# EAGLE board bed_prod (EAGLE 9.5.0), part 1 of 3
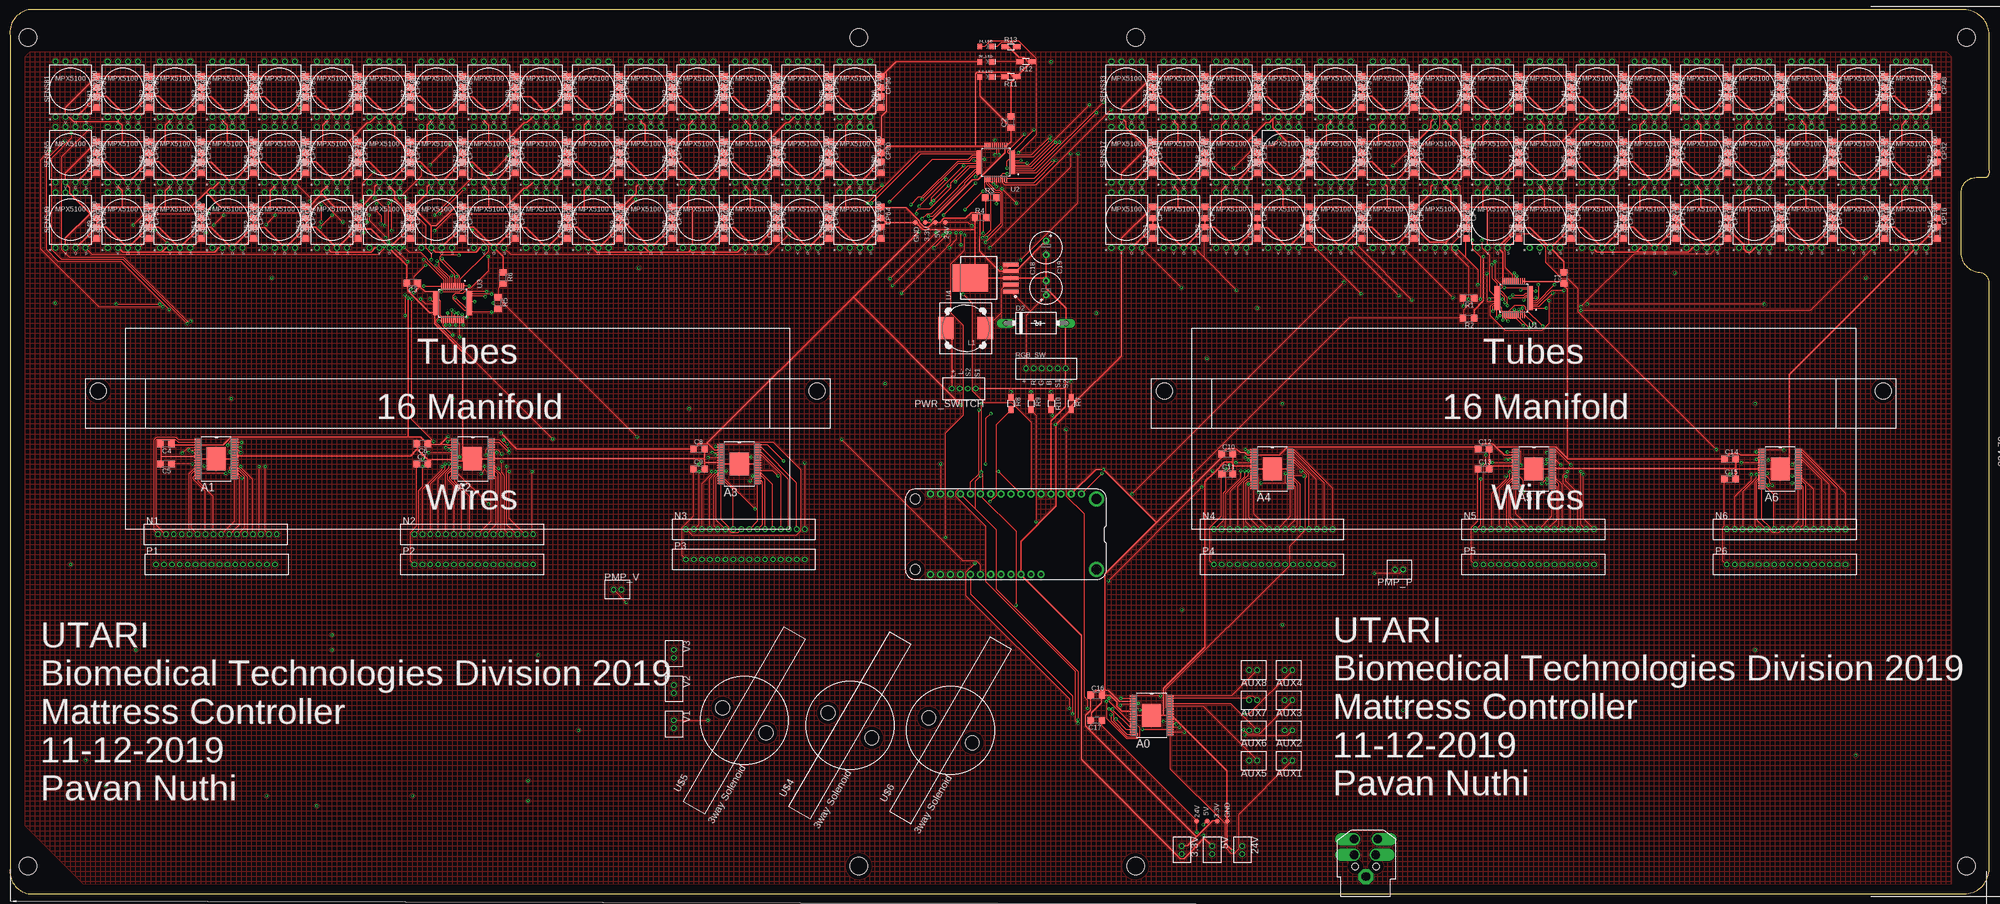
[diagram p2: board, top side]
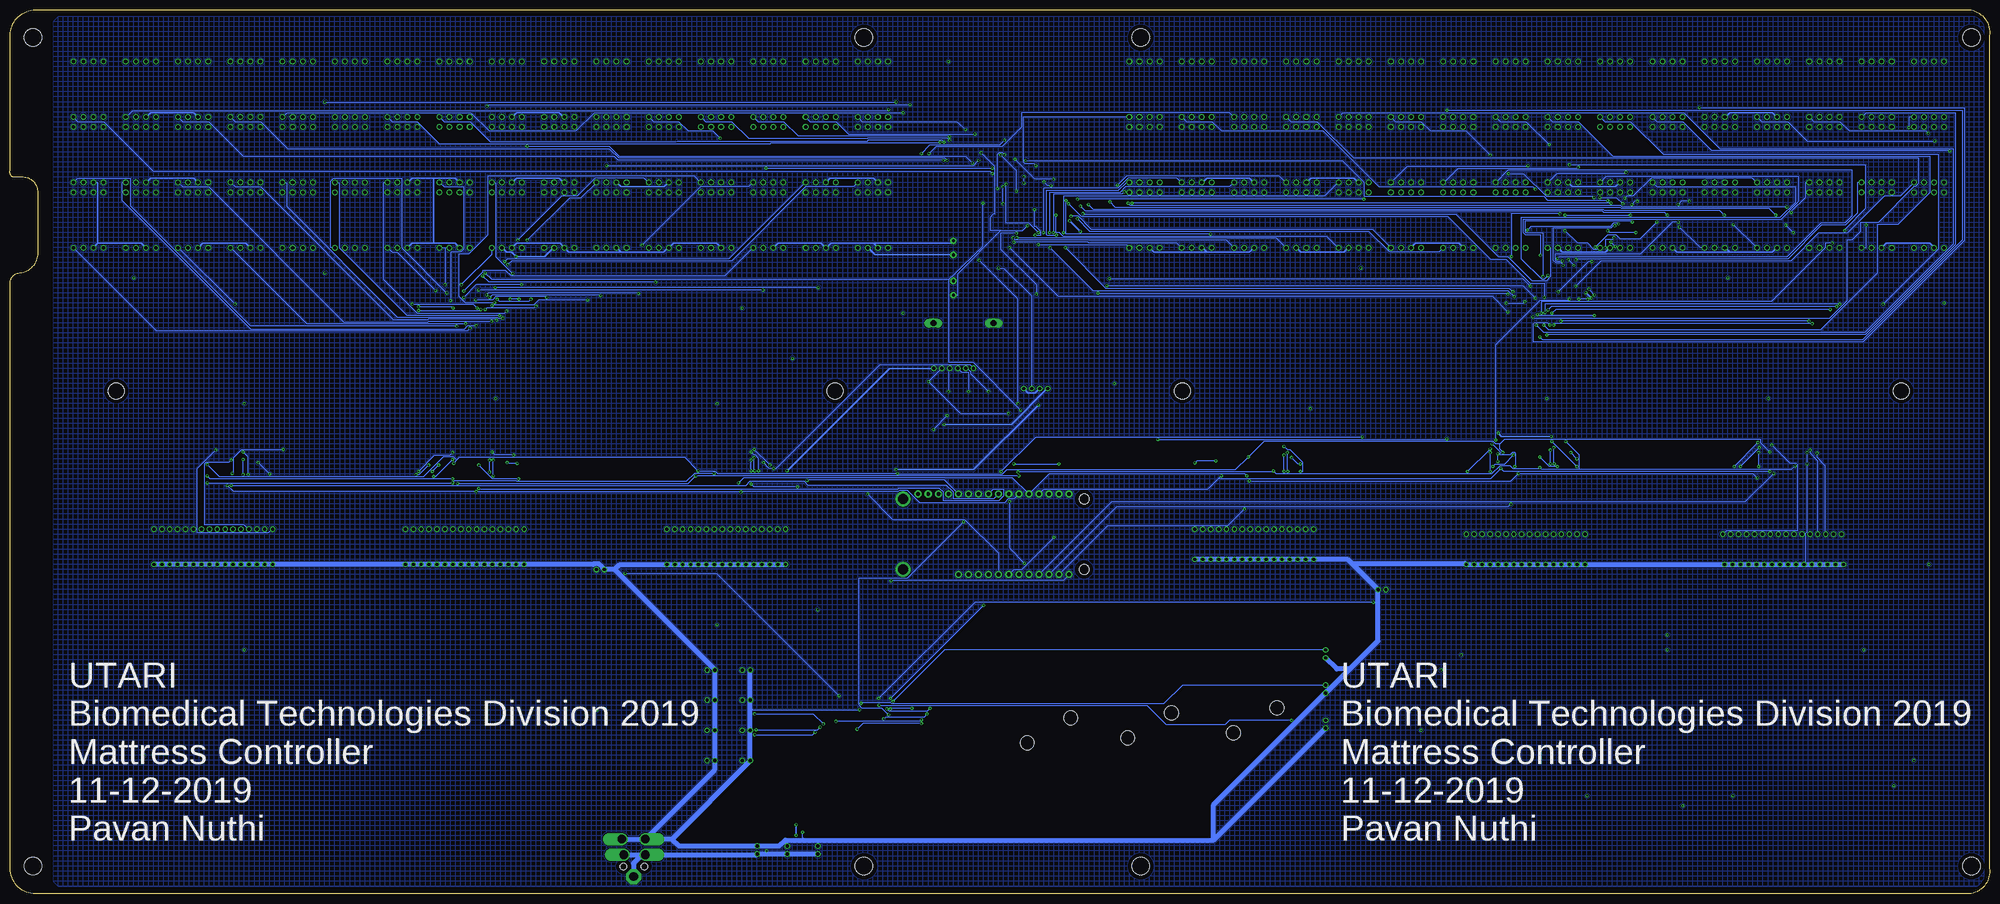
[diagram p3: board, bottom side, seen from below]

Size 499.97 x 223.3 mm. Coordinates in mm from the lower left corner, seen from the top.
Copper layers (1*16): Top 0.035mm / dielectric 1.5mm / Bottom 0.035mm
Design rules "default *": minimum track width 6mil, minimum drill 0.35mm, track to track 6mil, track to pad 6mil, pad to pad 6mil, via to via 6mil, smd to smd 6mil, copper to edge 40mil, drill to drill 6mil, minimum pad ring 10mil, minimum via ring 8mil, stop-mask expansion 4mil, vias tented up to drill 14mil, thermal gap 10mil
Net classes: 0 default: width 0.203 mm; 1 pwr: width 0.406 mm; 2 Vcc: width 1.27 mm

## Footprints (pad centres in the part's own frame; a part is rotated, then mirrored left to right if it is on the bottom)
LED-1206 = smd 1.2 x 1.4: A -1.5,0; C 1.5,0
2CONN_2MM = drill 0.85: P$1 0,0; P$2 2,0
SOIC65P1030X265-32N = smd 1.6 x 0.432: 1 -4.699,4.877; 2 -4.699,4.216; 3 -4.699,3.581; 4 -4.699,2.921; 5 -4.699,2.286; 6 -4.699,1.626; 7 -4.699,0.965; 8 -4.699,0.33; 9 -4.699,-0.33; 10 -4.699,-0.965; 11 -4.699,-1.626; 12 -4.699,-2.286; 13 -4.699,-2.921; 14 -4.699,-3.581; 15 -4.699,-4.216; 16 -4.699,-4.877; 17 4.699,-4.877; 18 4.699,-4.216; 19 4.699,-3.581; 20 4.699,-2.921; 21 4.699,-2.286; 22 4.699,-1.626; 23 4.699,-0.965; 24 4.699,-0.33; 25 4.699,0.33; 26 4.699,0.965; 27 4.699,1.626; 28 4.699,2.286; 29 4.699,2.921; 30 4.699,3.581; 31 4.699,4.216; 32 4.699,4.877 | smd 4.801 x 5.893: 33 0,0
C1206 = smd 1.6 x 1.8: 1 -1.4,0; 2 1.4,0
E3,5-8 = drill 0.813 pad 1.6: + -1.778,0 | drill 0.813 pad 1.6 octagon: - 1.778,0
DO201T15 = drill 1.499 long: A 7.62,0; C -7.62,0
KYCON-KPXJ-4S = drill 2.2 pad 3.81 octagon: GND 0,-8 | drill 2.2 pad 2.54 offset: GND_ -3,-2.5; GND__ 2.5,-2.5; V+ 3,1.5; V++ -3,1.5 | hole 1.7: 2.54,-5.461; -2.667,-5.461
DR127 = smd 3.85 x 5.5: 1 -4.975,0; 2 4.975,0
FEATHERWING_DIM = drill 1 pad 1.778: 1 6.35,1.27; 2 8.89,1.27; 3 11.43,1.27; 4 13.97,1.27; 5 16.51,1.27; 6 19.05,1.27; 7 21.59,1.27; 8 24.13,1.27; 9 26.67,1.27; 10 29.21,1.27; 11 31.75,1.27; 12 34.29,1.27; 13 36.83,1.27; 14 39.37,1.27; 15 41.91,1.27; 16 44.45,1.27; 17 44.45,21.59; 18 41.91,21.59; 19 39.37,21.59; 20 36.83,21.59; 21 34.29,21.59; 22 31.75,21.59; 23 29.21,21.59; 24 26.67,21.59; 25 24.13,21.59; 26 21.59,21.59; 27 19.05,21.59; 28 16.51,21.59 | drill 2.5 pad 3.81: P$1 2.54,20.32; P$2 2.54,2.54 | hole 2.54: 48.26,20.32; 48.26,2.54
16CONN_2MM = drill 0.85: P1 -2.54,15.24; P2 -2.54,13.24; P3 -2.54,11.24; P4 -2.54,9.24; P5 -2.54,7.24; P6 -2.54,5.24; P7 -2.54,3.24; P8 -2.54,1.24; P9 -2.54,-0.76; P10 -2.54,-2.76; P11 -2.54,-4.76; P12 -2.54,-6.76; P13 -2.54,-8.76; P14 -2.54,-10.76; P15 -2.54,-12.76; P16 -2.54,-14.76
4CONN_2MM = drill 0.85: P$1 0,0; P$2 2,0; P$3 4,0; P$4 6,0
R1206 = smd 1.6 x 1.803: 1 -1.422,0; 2 1.422,0
R1206W = smd 1.8 x 1.2: 1 -1.499,0; 2 1.499,0
6CONN_2MM = drill 0.85: P$1 0,0; P$2 2,0; P$3 4,0; P$4 6,0; P$5 8,0; P$6 10,0
98ASB17759C = drill 0.9: 1 0,0; 2 2.54,0; 3 5.08,0; 4 7.62,0; 5 7.62,14; 6 5.08,14; 7 2.54,14; 8 0,14
PAD.03X.05 = smd 1.27 x 1.27: P$1 0,0
QFP50P900X900X160-49N = smd 1.49 x 0.28: 1 -4.17,2.75; 2 -4.17,2.25; 3 -4.17,1.75; 4 -4.17,1.25; 5 -4.17,0.75; 6 -4.17,0.25; 7 -4.17,-0.25; 8 -4.17,-0.75; 9 -4.17,-1.25; 10 -4.17,-1.75; 11 -4.17,-2.25; 12 -4.17,-2.75; 25 4.17,-2.75; 26 4.17,-2.25; 27 4.17,-1.75; 28 4.17,-1.25; 29 4.17,-0.75; 30 4.17,-0.25; 31 4.17,0.25; 32 4.17,0.75; 33 4.17,1.25; 34 4.17,1.75; 35 4.17,2.25; 36 4.17,2.75 | smd 0.28 x 1.49: 13 -2.75,-4.17; 14 -2.25,-4.17; 15 -1.75,-4.17; 16 -1.25,-4.17; 17 -0.75,-4.17; 18 -0.25,-4.17; 19 0.25,-4.17; 20 0.75,-4.17; 21 1.25,-4.17; 22 1.75,-4.17; 23 2.25,-4.17; 24 2.75,-4.17; 37 2.75,4.17; 38 2.25,4.17; 39 1.75,4.17; 40 1.25,4.17; 41 0.75,4.17; 42 0.25,4.17; 43 -0.25,4.17; 44 -0.75,4.17; 45 -1.25,4.17; 46 -1.75,4.17; 47 -2.25,4.17; 48 -2.75,4.17
DPAK6P170_1524X459L254X81N = smd 1 x 4: 1 -3.4,-6.33; 2 -1.7,-6.33; 3 0,-6.33; 4 1.7,-6.33; 5 3.4,-6.33 | smd 7 x 9: 6 0,3.91
MANIFOLD16 = hole 4.089: 3.175,3.175; 184.785,3.175
PTS-25349-C = hole 4.5: 0,0; 209.3,0; 209.3,209.8; 0,209.8; 209.3,279.7; 0,279.7; 209.3,489.5; 0,489.5
EVO-3-24 = hole 3.556: 0,6.35; 0,-6.35

## Placement (x,y rotation side)
3.3_LED  yellow  [LED-1206]  246.45,206.39 0 top
3.3V  2CONN_2MM  [2CONN_2MM]  295.98,12.08 270 top
5V  2CONN_2MM  [2CONN_2MM]  303.6,12.08 270 top
5V_LED  RED  [LED-1206]  246.45,210.2 0 top
24_LED  GREEN  [LED-1206]  246.45,214.01 0 top
24V  2CONN_2MM  [2CONN_2MM]  311.22,12.08 270 top
A0  MC33996EKR2  [SOIC65P1030X265-32N]  288.36,45.1 0 top
A1  MC33996EKR2  [SOIC65P1030X265-32N]  52.14,109.87 0 top
A2  MC33996EKR2  [SOIC65P1030X265-32N]  116.91,109.87 0 top
A3  MC33996EKR2  [SOIC65P1030X265-32N]  184.22,108.6 0 top
A4  MC33996EKR2  [SOIC65P1030X265-32N]  318.84,107.33 0 top
A5  MC33996EKR2  [SOIC65P1030X265-32N]  384.88,107.33 0 top
A6  MC33996EKR2  [SOIC65P1030X265-32N]  447.11,107.33 0 top
AUX1  2CONN_2MM  [2CONN_2MM]  323.92,33.67 180 top
AUX2  2CONN_2MM  [2CONN_2MM]  323.92,41.29 180 top
AUX3  2CONN_2MM  [2CONN_2MM]  323.92,48.91 180 top
AUX4  2CONN_2MM  [2CONN_2MM]  323.92,56.53 180 top
AUX5  2CONN_2MM  [2CONN_2MM]  315.03,33.67 180 top
AUX6  2CONN_2MM  [2CONN_2MM]  315.03,41.29 180 top
AUX7  2CONN_2MM  [2CONN_2MM]  315.03,48.91 180 top
AUX8  2CONN_2MM  [2CONN_2MM]  315.03,56.53 180 top
C1  0.1uF  [C1206]  392.5,155.59 90 top
C2  0.1uF  [C1206]  252.8,194.96 90 top
C3  0.1uF  [C1206]  101.67,154.32 180 top
C4  0.1uF  [C1206]  39.44,113.68 180 top
C5  0.1uF  [C1206]  39.44,108.6 180 top
C6  0.1uF  [C1206]  104.21,113.68 180 top
C7  0.1uF  [C1206]  104.21,108.6 0 top
C8  0.1uF  [C1206]  174.06,112.41 0 top
C9  0.1uF  [C1206]  174.06,107.33 0 top
C10  0.1uF  [C1206]  307.41,111.14 0 top
C11  0.1uF  [C1206]  307.41,106.06 0 top
C12  0.1uF  [C1206]  372.18,112.41 0 top
C13  0.1uF  [C1206]  372.18,107.33 0 top
C14  0.1uF  [C1206]  434.41,109.87 0 top
C15  0.1uF  [C1206]  434.41,104.79 0 top
C16  0.1uF  [C1206]  274.39,50.18 0 top
C17  0.1uF  [C1206]  274.39,43.83 180 top
C18  100uF,50V  [E3,5-8]  261.69,153.05 90 top
C19  330uF,10V  [E3,5-8]  261.69,163.21 270 top
CP1  1uF  [C1206]  288.61,172.1 270 top
CP2  1uF  [C1206]  301.82,172.1 270 top
CP3  1uF  [C1206]  315.03,172.1 270 top
CP4  1uF  [C1206]  328.23,172.1 270 top
CP5  1uF  [C1206]  341.44,172.1 270 top
CP6  [C1206]  354.65,172.1 270 top
CP7  [C1206]  367.86,172.1 270 top
CP8  1uF  [C1206]  381.07,172.1 270 top
CP9  1uF  [C1206]  394.27,172.1 270 top
CP10  1uF  [C1206]  407.48,172.1 270 top
CP11  1uF  [C1206]  420.69,172.1 270 top
CP12  1uF  [C1206]  433.9,172.1 270 top
CP13  1uF  [C1206]  447.11,172.1 270 top
CP14  [C1206]  460.31,172.1 270 top
CP15  [C1206]  473.52,172.1 270 top
CP16  [C1206]  486.73,172.1 270 top
CP17  1uF  [C1206]  288.61,188.61 270 top
CP18  [C1206]  301.82,188.61 270 top
CP19  [C1206]  315.03,188.61 270 top
CP20  [C1206]  328.23,188.61 270 top
CP21  [C1206]  341.44,188.61 270 top
CP22  [C1206]  354.65,188.61 270 top
CP23  [C1206]  367.86,188.61 270 top
CP24  [C1206]  381.07,188.61 270 top
CP25  [C1206]  394.27,188.61 270 top
CP26  [C1206]  407.48,188.61 270 top
CP27  [C1206]  420.69,188.61 270 top
CP28  [C1206]  433.9,188.61 270 top
CP29  [C1206]  447.11,188.61 270 top
CP30  [C1206]  460.31,188.61 270 top
CP31  [C1206]  473.52,188.61 270 top
CP32  [C1206]  486.73,188.61 270 top
CP33  [C1206]  288.61,205.12 270 top
CP34  [C1206]  301.82,205.12 270 top
CP35  [C1206]  315.03,205.12 270 top
CP36  [C1206]  328.23,205.12 270 top
CP37  [C1206]  341.44,205.12 270 top
CP38  [C1206]  354.65,205.12 270 top
CP39  [C1206]  367.86,205.12 270 top
CP40  [C1206]  381.07,205.12 270 top
CP41  [C1206]  394.27,205.12 270 top
CP42  [C1206]  407.48,205.12 270 top
CP43  [C1206]  420.69,205.12 270 top
CP44  [C1206]  433.9,205.12 270 top
CP45  [C1206]  447.11,205.12 270 top
CP46  [C1206]  460.31,205.12 270 top
CP47  [C1206]  473.52,205.12 270 top
CP48  [C1206]  486.73,205.12 270 top
CP49  [C1206]  21.91,172.1 270 top
CP50  [C1206]  35.12,172.1 270 top
CP51  [C1206]  48.33,172.1 270 top
CP52  [C1206]  61.53,172.1 270 top
CP53  [C1206]  74.74,172.1 270 top
CP54  [C1206]  87.95,172.1 270 top
CP55  [C1206]  101.16,172.1 270 top
CP56  [C1206]  114.37,172.1 270 top
CP57  [C1206]  127.57,172.1 270 top
CP58  [C1206]  140.78,172.1 270 top
CP59  [C1206]  153.99,172.1 270 top
CP60  [C1206]  167.2,172.1 270 top
CP61  [C1206]  180.41,172.1 270 top
CP62  [C1206]  193.61,172.1 270 top
CP63  [C1206]  206.82,172.1 270 top
CP64  [C1206]  220.03,172.1 270 top
CP65  [C1206]  21.91,188.61 270 top
CP66  [C1206]  35.12,188.61 270 top
CP67  [C1206]  48.33,188.61 270 top
CP68  [C1206]  61.53,188.61 270 top
CP69  [C1206]  74.74,188.61 270 top
CP70  [C1206]  87.95,188.61 270 top
CP71  [C1206]  101.16,188.61 270 top
CP72  [C1206]  114.37,188.61 270 top
CP73  [C1206]  127.57,188.61 270 top
CP74  [C1206]  140.78,188.61 270 top
CP75  [C1206]  153.99,188.61 270 top
CP76  [C1206]  167.2,188.61 270 top
CP77  [C1206]  180.41,188.61 270 top
CP78  [C1206]  193.61,188.61 270 top
CP79  [C1206]  206.82,188.61 270 top
CP80  [C1206]  220.03,188.61 270 top
CP81  [C1206]  21.91,205.12 270 top
CP82  [C1206]  35.12,205.12 270 top
CP83  [C1206]  48.33,205.12 270 top
CP84  [C1206]  61.53,205.12 270 top
CP85  [C1206]  74.74,205.12 270 top
CP86  [C1206]  87.95,205.12 270 top
CP87  [C1206]  101.16,205.12 270 top
CP88  [C1206]  114.37,205.12 270 top
CP89  [C1206]  127.57,205.12 270 top
CP90  [C1206]  140.78,205.12 270 top
CP91  [C1206]  153.99,205.12 270 top
CP92  [C1206]  167.2,205.12 270 top
CP93  [C1206]  180.41,205.12 270 top
CP94  [C1206]  193.61,205.12 270 top
CP95  [C1206]  206.82,205.12 270 top
CP96  [C1206]  220.03,205.12 270 top
CS1  [C1206]  288.61,167.02 90 top
CS2  [C1206]  301.82,167.02 90 top
CS3  [C1206]  315.03,167.02 90 top
CS4  [C1206]  328.23,167.02 90 top
CS5  [C1206]  341.44,167.02 90 top
CS6  [C1206]  354.65,167.02 90 top
CS7  [C1206]  367.86,167.02 90 top
CS8  470pF  [C1206]  381.07,167.02 90 top
CS9  [C1206]  394.27,167.02 90 top
CS10  [C1206]  407.48,167.02 90 top
CS11  [C1206]  420.69,167.02 90 top
CS12  [C1206]  433.9,167.02 90 top
CS13  [C1206]  447.11,167.02 90 top
CS14  [C1206]  460.31,167.02 90 top
CS15  [C1206]  473.52,167.02 90 top
CS16  [C1206]  486.73,167.02 90 top
CS17  [C1206]  288.61,183.53 90 top
CS18  [C1206]  301.82,183.53 90 top
CS19  [C1206]  315.03,183.53 90 top
CS20  [C1206]  328.23,183.53 90 top
CS21  [C1206]  341.44,183.53 90 top
CS22  [C1206]  354.65,183.53 90 top
CS23  [C1206]  367.86,183.53 90 top
CS24  [C1206]  381.07,183.53 90 top
CS25  [C1206]  394.27,183.53 90 top
CS26  [C1206]  407.48,183.53 90 top
CS27  [C1206]  420.69,183.53 90 top
CS28  [C1206]  433.9,183.53 90 top
CS29  [C1206]  447.11,183.53 90 top
CS30  [C1206]  460.31,183.53 90 top
CS31  [C1206]  473.52,183.53 90 top
CS32  [C1206]  486.73,183.53 90 top
CS33  [C1206]  288.61,200.04 90 top
CS34  [C1206]  301.82,200.04 90 top
CS35  [C1206]  315.03,200.04 90 top
CS36  [C1206]  328.23,200.04 90 top
CS37  [C1206]  341.44,200.04 90 top
CS38  [C1206]  354.65,200.04 90 top
CS39  [C1206]  367.86,200.04 90 top
CS40  [C1206]  381.07,200.04 90 top
CS41  [C1206]  394.27,200.04 90 top
CS42  [C1206]  407.48,200.04 90 top
CS43  [C1206]  420.69,200.04 90 top
CS44  [C1206]  433.9,200.04 90 top
CS45  [C1206]  447.11,200.04 90 top
CS46  [C1206]  460.31,200.04 90 top
CS47  [C1206]  473.52,200.04 90 top
CS48  [C1206]  486.73,200.04 90 top
CS49  [C1206]  21.91,167.02 90 top
CS50  [C1206]  35.12,167.02 90 top
CS51  [C1206]  48.33,167.02 90 top
CS52  [C1206]  61.53,167.02 90 top
CS53  [C1206]  74.74,167.02 90 top
CS54  [C1206]  87.95,167.02 90 top
CS55  [C1206]  101.16,167.02 90 top
CS56  [C1206]  114.37,167.02 90 top
CS57  [C1206]  127.57,167.02 90 top
CS58  [C1206]  140.78,167.02 90 top
CS59  [C1206]  153.99,167.02 90 top
CS60  [C1206]  167.2,167.02 90 top
CS61  [C1206]  180.41,167.02 90 top
CS62  [C1206]  193.61,167.02 90 top
CS63  [C1206]  206.82,167.02 90 top
CS64  [C1206]  220.03,167.02 90 top
CS65  [C1206]  21.91,183.53 90 top
CS66  [C1206]  35.12,183.53 90 top
CS67  [C1206]  48.33,183.53 90 top
CS68  [C1206]  61.53,183.53 90 top
CS69  [C1206]  74.74,183.53 90 top
CS70  [C1206]  87.95,183.53 90 top
CS71  [C1206]  101.16,183.53 90 top
CS72  [C1206]  114.37,183.53 90 top
CS73  [C1206]  127.57,183.53 90 top
CS74  [C1206]  140.78,183.53 90 top
CS75  [C1206]  153.99,183.53 90 top
CS76  [C1206]  167.2,183.53 90 top
CS77  [C1206]  180.41,183.53 90 top
CS78  [C1206]  193.61,183.53 90 top
CS79  [C1206]  206.82,183.53 90 top
CS80  [C1206]  220.03,183.53 90 top
CS81  [C1206]  21.91,200.04 90 top
CS82  [C1206]  35.12,200.04 90 top
CS83  [C1206]  48.33,200.04 90 top
CS84  [C1206]  61.53,200.04 90 top
CS85  [C1206]  74.74,200.04 90 top
CS86  [C1206]  87.95,200.04 90 top
CS87  [C1206]  101.16,200.04 90 top
CS88  [C1206]  114.37,200.04 90 top
CS89  [C1206]  127.57,200.04 90 top
CS90  [C1206]  140.78,200.04 90 top
CS91  [C1206]  153.99,200.04 90 top
CS92  [C1206]  167.2,200.04 90 top
CS93  [C1206]  180.41,200.04 90 top
CS94  [C1206]  193.61,200.04 90 top
CS95  [C1206]  206.82,200.04 90 top
CS96  [C1206]  220.03,200.04 90 top
D2  1N5822  [DO201T15]  259.15,144.16 0 top
FRAME1  FRAME-LEDGER  [CREATIVE_COMMONS]  4.89,87.77 90 bottom
FRAME2  FRAME-LEDGER  [CREATIVE_COMMONS]  498.16,116.22 270 bottom
J1  KPJX-4S-S  [KYCON-KPXJ-4S]  342.46,12.33 0 top
L1  330uH  [DR127]  241.37,142.89 180 top
MS1  FEATHERWING_NODIM  [FEATHERWING_DIM]  276.93,102.25 180 top
N1  16CONN_2MM  [16CONN_2MM]  52.14,88.28 270 top
N2  16CONN_2MM  [16CONN_2MM]  116.91,88.28 270 top
N3  16CONN_2MM  [16CONN_2MM]  185.49,89.55 270 top
N4  16CONN_2MM  [16CONN_2MM]  318.84,89.55 270 top
N5  16CONN_2MM  [16CONN_2MM]  384.88,89.55 270 top
N6  16CONN_2MM  [16CONN_2MM]  448.38,89.55 270 top
P1  16CONN_2MM  [16CONN_2MM]  52.14,85.74 90 top
P2  16CONN_2MM  [16CONN_2MM]  116.91,80.66 270 top
P3  16CONN_2MM  [16CONN_2MM]  185.49,81.93 270 top
P4  16CONN_2MM  [16CONN_2MM]  318.84,80.66 270 top
P5  16CONN_2MM  [16CONN_2MM]  384.88,80.66 270 top
P6  16CONN_2MM  [16CONN_2MM]  448.38,80.66 270 top
PMP_P  2CONN_2MM  [2CONN_2MM]  351.86,81.93 180 top
PMP_V  2CONN_2MM  [2CONN_2MM]  152.47,76.85 0 top
PWR_SWITCH  4CONN_2MM  [4CONN_2MM]  243.91,127.65 180 top
R1  1k  [R1206]  368.37,150.51 180 top
R2  2k  [R1206]  368.37,145.43 180 top
R3  1k  [R1206]  247.72,175.91 0 top
R4  2k  [R1206]  245.18,170.83 0 top
R5  1k  [R1206]  123.26,149.24 270 top
R6  2k  [R1206]  124.53,155.59 270 top
R7  5k  [R1206W]  268.04,123.84 270 top
R8  5K  [R1206W]  252.8,123.84 270 top
R9  5k  [R1206W]  257.88,123.84 270 top
R10  5k  [R1206W]  262.96,123.84 270 top
R11  5k  [R1206W]  252.8,206.39 180 top
R12  5k  [R1206W]  256.61,210.2 180 top
R13  10k  [R1206W]  252.8,214.01 0 top
RGB_SW  6CONN_2MM  [6CONN_2MM]  256.61,132.73 0 top
SENS1  MPX5100  [98ASB17759C]  278.2,163.21 0 top
SENS2  MPX5100  [98ASB17759C]  291.4,163.21 0 top
SENS3  MPX5100  [98ASB17759C]  304.61,163.21 0 top
SENS4  MPX5100  [98ASB17759C]  317.82,163.21 0 top
SENS5  MPX5100  [98ASB17759C]  331.03,163.21 0 top
SENS6  MPX5100  [98ASB17759C]  344.24,163.21 0 top
SENS7  MPX5100  [98ASB17759C]  357.44,163.21 0 top
SENS8  MPX5100  [98ASB17759C]  370.65,163.21 0 top
SENS9  MPX5100  [98ASB17759C]  383.86,163.21 0 top
SENS10  MPX5100  [98ASB17759C]  397.07,163.21 0 top
SENS11  MPX5100  [98ASB17759C]  410.28,163.21 0 top
SENS12  MPX5100  [98ASB17759C]  423.48,163.21 0 top
SENS13  MPX5100  [98ASB17759C]  436.69,163.21 0 top
SENS14  MPX5100  [98ASB17759C]  449.9,163.21 0 top
SENS15  MPX5100  [98ASB17759C]  463.11,163.21 0 top
SENS16  MPX5100  [98ASB17759C]  476.32,163.21 0 top
SENS17  MPX5100  [98ASB17759C]  278.2,179.72 0 top
SENS18  MPX5100  [98ASB17759C]  291.4,179.72 0 top
SENS19  MPX5100  [98ASB17759C]  304.61,179.72 0 top
SENS20  MPX5100  [98ASB17759C]  317.82,179.72 0 top
SENS21  MPX5100  [98ASB17759C]  331.03,179.72 0 top
SENS22  MPX5100  [98ASB17759C]  344.24,179.72 0 top
SENS23  MPX5100  [98ASB17759C]  357.44,179.72 0 top
SENS24  MPX5100  [98ASB17759C]  370.65,179.72 0 top
SENS25  MPX5100  [98ASB17759C]  383.86,179.72 0 top
SENS26  MPX5100  [98ASB17759C]  397.07,179.72 0 top
SENS27  MPX5100  [98ASB17759C]  410.28,179.72 0 top
SENS28  MPX5100  [98ASB17759C]  423.48,179.72 0 top
SENS29  MPX5100  [98ASB17759C]  436.69,179.72 0 top
SENS30  MPX5100  [98ASB17759C]  449.9,179.72 0 top
SENS31  MPX5100  [98ASB17759C]  463.11,179.72 0 top
SENS32  MPX5100  [98ASB17759C]  476.32,179.72 0 top
SENS33  MPX5100  [98ASB17759C]  278.2,196.23 0 top
SENS34  MPX5100  [98ASB17759C]  291.4,196.23 0 top
SENS35  MPX5100  [98ASB17759C]  304.61,196.23 0 top
SENS36  MPX5100  [98ASB17759C]  317.82,196.23 0 top
SENS37  MPX5100  [98ASB17759C]  331.03,196.23 0 top
SENS38  MPX5100  [98ASB17759C]  344.24,196.23 0 top
SENS39  MPX5100  [98ASB17759C]  357.44,196.23 0 top
SENS40  MPX5100  [98ASB17759C]  370.65,196.23 0 top
SENS41  MPX5100  [98ASB17759C]  383.86,196.23 0 top
SENS42  MPX5100  [98ASB17759C]  397.07,196.23 0 top
SENS43  MPX5100  [98ASB17759C]  410.28,196.23 0 top
SENS44  MPX5100  [98ASB17759C]  423.48,196.23 0 top
SENS45  MPX5100  [98ASB17759C]  436.69,196.23 0 top
SENS46  MPX5100  [98ASB17759C]  449.9,196.23 0 top
SENS47  MPX5100  [98ASB17759C]  463.11,196.23 0 top
SENS48  MPX5100  [98ASB17759C]  476.32,196.23 0 top
SENS49  MPX5100  [98ASB17759C]  11.5,163.21 0 top
SENS50  MPX5100  [98ASB17759C]  24.7,163.21 0 top
SENS51  MPX5100  [98ASB17759C]  37.91,163.21 0 top
SENS52  MPX5100  [98ASB17759C]  51.12,163.21 0 top
SENS53  MPX5100  [98ASB17759C]  64.33,163.21 0 top
SENS54  MPX5100  [98ASB17759C]  77.54,163.21 0 top
SENS55  MPX5100  [98ASB17759C]  90.74,163.21 0 top
SENS56  MPX5100  [98ASB17759C]  103.95,163.21 0 top
SENS57  MPX5100  [98ASB17759C]  117.16,163.21 0 top
SENS58  MPX5100  [98ASB17759C]  130.37,163.21 0 top
SENS59  MPX5100  [98ASB17759C]  143.58,163.21 0 top
SENS60  MPX5100  [98ASB17759C]  156.78,163.21 0 top
SENS61  MPX5100  [98ASB17759C]  169.99,163.21 0 top
SENS62  MPX5100  [98ASB17759C]  183.2,163.21 0 top
SENS63  MPX5100  [98ASB17759C]  196.41,163.21 0 top
SENS64  MPX5100  [98ASB17759C]  209.62,163.21 0 top
SENS65  MPX5100  [98ASB17759C]  11.5,179.72 0 top
SENS66  MPX5100  [98ASB17759C]  24.7,179.72 0 top
SENS67  MPX5100  [98ASB17759C]  37.91,179.72 0 top
SENS68  MPX5100  [98ASB17759C]  51.12,179.72 0 top
SENS69  MPX5100  [98ASB17759C]  64.33,179.72 0 top
SENS70  MPX5100  [98ASB17759C]  77.54,179.72 0 top
SENS71  MPX5100  [98ASB17759C]  90.74,179.72 0 top
SENS72  MPX5100  [98ASB17759C]  103.95,179.72 0 top
SENS73  MPX5100  [98ASB17759C]  117.16,179.72 0 top
SENS74  MPX5100  [98ASB17759C]  130.37,179.72 0 top
SENS75  MPX5100  [98ASB17759C]  143.58,179.72 0 top
SENS76  MPX5100  [98ASB17759C]  156.78,179.72 0 top
SENS77  MPX5100  [98ASB17759C]  169.99,179.72 0 top
SENS78  MPX5100  [98ASB17759C]  183.2,179.72 0 top
SENS79  MPX5100  [98ASB17759C]  196.41,179.72 0 top
SENS80  MPX5100  [98ASB17759C]  209.62,179.72 0 top
SENS81  MPX5100  [98ASB17759C]  11.5,196.23 0 top
SENS82  MPX5100  [98ASB17759C]  24.7,196.23 0 top
SENS83  MPX5100  [98ASB17759C]  37.91,196.23 0 top
SENS84  MPX5100  [98ASB17759C]  51.12,196.23 0 top
SENS85  MPX5100  [98ASB17759C]  64.33,196.23 0 top
SENS86  MPX5100  [98ASB17759C]  77.54,196.23 0 top
SENS87  MPX5100  [98ASB17759C]  90.74,196.23 0 top
SENS88  MPX5100  [98ASB17759C]  103.95,196.23 0 top
SENS89  MPX5100  [98ASB17759C]  117.16,196.23 0 top
SENS90  MPX5100  [98ASB17759C]  130.37,196.23 0 top
SENS91  MPX5100  [98ASB17759C]  143.58,196.23 0 top
SENS92  MPX5100  [98ASB17759C]  156.78,196.23 0 top
SENS93  MPX5100  [98ASB17759C]  169.99,196.23 0 top
SENS94  MPX5100  [98ASB17759C]  183.2,196.23 0 top
SENS95  MPX5100  [98ASB17759C]  196.41,196.23 0 top
SENS96  MPX5100  [98ASB17759C]  209.62,196.23 0 top
TP1  TEST-POINT3X5  [PAD.03X.05]  299.79,18.43 90 top
TP2  TEST-POINT3X5  [PAD.03X.05]  302.33,18.43 90 top
TP3  TEST-POINT3X5  [PAD.03X.05]  304.87,18.43 90 top
TP4  TEST-POINT3X5  [PAD.03X.05]  307.41,18.43 90 top
TP5  TEST-POINT3X5  [PAD.03X.05]  236.29,169.56 270 top
TP6  TEST-POINT3X5  [PAD.03X.05]  233.75,169.56 270 top
TP7  TEST-POINT3X5  [PAD.03X.05]  231.21,169.56 270 top
TP8  TEST-POINT3X5  [PAD.03X.05]  228.67,169.56 270 top
U1  ADG731  [QFP50P900X900X160-49N]  379.8,150.51 180 top
U2  ADG731  [QFP50P900X900X160-49N]  248.99,184.8 180 top
U3  ADG731  [QFP50P900X900X160-49N]  111.83,149.24 270 top
U4  LM2576-5.0WU  [DPAK6P170_1524X459L254X81N]  246.45,155.59 90 top
U$1  [MANIFOLD16]  207.08,130.19 180 top
U$2  [PTS-25349-C]  494.1,7 90 top
U$3  [MANIFOLD16]  476.32,130.19 180 top
U$4  [EVO-3-24]  212.16,42.56 60 top
U$5  [EVO-3-24]  185.49,43.83 60 top
U$6  [EVO-3-24]  237.56,41.29 60 top
V1  2CONN_2MM  [2CONN_2MM]  167.71,43.83 270 top
V2  2CONN_2MM  [2CONN_2MM]  167.71,52.72 270 top
V3  2CONN_2MM  [2CONN_2MM]  167.71,61.61 270 top

## Tracks (layer width: path | path; a pad name or v marks a point on that pad's centre or on a via)
A0  (via drill 0.35)
  Top 0.203: R1.1 369.64,150.51 369.64,150.03 367.1,147.49 367.1,145.43 R2.2 338.2,145.43 298.67,105.9 v298.67,104.47
  Bottom 0.203: MS1.5 264.07,104.63 298.52,104.63 v298.67,104.47
A1  (via drill 0.35)
  Top 0.203: 246.45,170.83 246.45,175.91 R3.1 | MS1.6 257.88,119.24 252.95,124.16 245.97,124.16 242.95,127.17 242.95,149.24 v240.73,151.46 | v245.81,166.86 245.81,170.2 246.45,170.83 | 246.45,170.83 R4.2
  Bottom 0.203: v240.73,151.46 240.73,153.84 249.78,162.89 249.78,166.86 v245.81,166.86
A2  (via drill 0.35)
  Top 0.203: R6.2 123.26,152.89 R5.1 123.26,150.51 v158.34,115.43 | MS1.7 v249.62,106.7
  Bottom 0.203: v158.34,115.43 240.89,115.43 v249.62,106.7
AUX1
  Top 0.203: AUX1.P$1 310.26,20.02 310.26,11.29 309.15,10.18 308.52,10.18 306.93,11.76 306.93,17.64 293.12,31.45 293.12,40.18 A0.17
AUX2  (via drill 0.35)
  Top 0.203: v296.61,40.81 293.12,40.81 A0.18 | v311.85,40.18 312.17,40.18 312.49,39.86 322.49,39.86 AUX2.P$1
  Bottom 0.203: v296.61,40.81 297.25,40.18 v311.85,40.18
AUX3  (via drill 0.35)
  Top 0.203: v295.34,42.08 293.12,42.08 A0.20 | v311.53,41.45 312.64,40.34 315.5,40.34 323.92,48.75 AUX3.P$1
  Bottom 0.203: v295.34,42.08 295.98,41.45 v311.53,41.45
AUX4  (via drill 0.35)
  Top 0.203: v294.55,42.88 293.12,42.88 A0.21 | v311.85,45.42 312.96,45.42 323.92,56.37 AUX4.P$1
  Bottom 0.203: v294.55,42.88 297.09,45.42 v311.85,45.42
AUX5
  Top 0.203: AUX5.P$1 301.37,47.32 293.12,47.32 A0.28
AUX6
  Top 0.203: AUX6.P$1 308.36,47.96 293.12,47.96 A0.29
AUX7
  Top 0.203: AUX7.P$1 314.07,49.86 312.64,49.86 312.17,49.39 293.12,49.39 A0.31
AUX8
  Top 0.203: AUX8.P$1 308.52,50.02 293.12,50.02 A0.32
B  (via drill 0.35)
  Top 0.203: v262.96,126.86 R10.1
  Bottom 0.203: v262.96,126.86 262.96,132.73 RGB_SW.P$4
B_LED  (via drill 0.35)
  Top 0.203: v277.56,46.69 278.67,45.58 278.67,43.83 282.16,40.34 283.59,40.34 A0.16 | v272.16,46.85 272.16,48.91 271.21,49.86 271.21,96.06 266.77,100.5 v266.77,117.33 | v263.27,120.82 263.27,121.94 262.96,122.25 R10.2
  Bottom 0.203: v277.56,46.69 277.4,46.85 v272.16,46.85 | v263.27,120.82 v266.77,117.33
DEMUX0  (via drill 0.35)
  Top 0.203: v279.31,44.15 281.85,41.61 283.59,41.61 A0.14 | v268.35,45.42 268.35,50.02 242.64,75.74 MS1.21
  Bottom 0.203: v279.31,44.15 278.83,44.62 269.15,44.62 v268.35,45.42
DEMUX1  (via drill 0.35)
  Top 0.203: v54.52,106.22 47.53,106.22 A1.14
  Bottom 0.203: v54.52,106.22 61.66,99.08 221.68,99.08 MS1.20
DEMUX2  (via drill 0.35)
  Top 0.203: v120.87,98.44 113.1,106.22 112.3,106.22 A2.14
  Bottom 0.203: v120.87,98.44 121.51,97.81 220.41,97.81 MS1.19
DEMUX3  (via drill 0.35)
  Top 0.203: v188.18,97.17 180.41,104.95 179.61,104.95 A3.14
  Bottom 0.203: v188.18,97.17 192.31,93.04 222.63,93.04 MS1.18
DEMUX4  (via drill 0.35)
  Top 0.203: v312.8,103.52 312.96,103.68 314.07,103.68 A4.14 | v277.4,79.07 v301.06,102.73
  Bottom 0.203: v312.8,103.52 312.01,102.73 v301.06,102.73 | v277.4,79.07 277.24,79.23 233.9,79.23 MS1.17
DEMUX5  (via drill 0.35)
  Top 0.203: v381.54,102.41 381.54,103.2 381.07,103.68 380.27,103.68 A5.14
  Bottom 0.203: v381.54,102.41 381.22,102.09 275.81,102.09 275.5,102.41 265.18,102.41 264.23,101.46 264.23,99.23 250.26,99.23 248.99,100.5 248.99,102.25 251.53,102.25 MS1.8
DEMUX6  (via drill 0.35)
  Top 0.203: v444.09,103.2 443.61,103.68 442.5,103.68 A6.14
  Bottom 0.203: v444.09,103.2 443.93,103.04 314.23,103.04 313.12,104.16 299.31,104.16 298.36,103.2 263.43,103.2 261.69,101.46 261.69,99.71 251.53,99.71 MS1.9
G  (via drill 0.35)
  Top 0.203: v257.88,126.86 R9.1
  Bottom 0.203: v257.88,126.86 257.88,131.78 259.62,131.78 260.57,132.73 RGB_SW.P$3
G_LED  (via drill 0.35)
  Top 0.203: v278.04,45.26 278.04,43.83 282.16,39.7 284.55,39.7 284.86,40.02 284.86,40.5 284.55,40.81 283.75,40.81 A0.15 | v259.15,94 259.15,120.98 257.88,122.25 R9.2
  Bottom 0.203: v278.04,45.26 279.78,47 284.86,47 285.66,47.8 285.66,79.71 273.43,79.71 v259.15,94
GND  (via drill 0.35)
  Top 0.406: CS33.2 288.67,201.47 288.67,203.69 CP33.2 | SENS33.3 283.43,196.23 288.51,201.31 CS33.2 | CS34.2 301.85,201.47 301.85,203.69 CP34.2 | CS34.2 301.69,201.31 296.61,196.23 SENS34.3 296.29,196.23 291.05,201.47 288.83,201.47 CS33.2 | CP35.2 CS35.2 | CS35.2 314.87,201.47 309.63,196.23 SENS35.3 309.47,196.23 304.23,201.47 302.01,201.47 CS34.2 | CS36.2 328.2,201.47 328.2,203.69 CP36.2 | CS36.2 328.04,201.47 322.8,196.23 SENS36.3 322.65,196.23 317.57,201.31 315.18,201.31 CS35.2 | CS37.2 341.54,201.47 341.54,203.69 CP37.2 | CS37.2 341.38,201.31 336.3,196.23 SENS37.3 335.98,196.39 331.06,201.31 328.36,201.31 CS36.2 | CS38.2 354.71,201.47 354.71,203.69 CP38.2 | CS38.2 354.55,201.31 349.47,196.23 SENS38.3 349.16,196.23 343.92,201.47 341.7,201.47 CS37.2 | CS39.2 367.89,201.47 367.89,203.69 CP39.2 | CS39.2 367.73,201.31 362.65,196.23 SENS39.3 | CP40.2 CS40.2 | CS40.2 380.91,201.47 375.67,196.23 SENS40.3 375.51,196.23 370.27,201.47 368.05,201.47 CS39.2 | CS38.2 354.87,201.47 357.09,201.47 362.33,196.23 SENS39.3 | CS41.2 394.24,201.47 394.24,203.69 CP41.2 | CS41.2 394.08,201.47 388.84,196.23 SENS41.3 388.69,196.23 383.61,201.31 381.22,201.31 CS40.2 | CS42.2 407.58,201.47 407.58,203.69 CP42.2 | CS42.2 407.42,201.31 402.34,196.23 SENS42.3 402.02,196.39 397.1,201.31 394.4,201.31 CS41.2 | CS43.2 420.75,201.47 420.75,203.69 CP43.2 | CS43.2 420.59,201.31 415.51,196.23 SENS43.3 415.2,196.23 409.96,201.47 407.74,201.47 CS42.2 | CS44.2 433.93,201.47 433.93,203.69 CP44.2 | CS44.2 433.77,201.31 428.69,196.23 SENS44.3 428.37,196.23 423.13,201.47 420.91,201.47 CS43.2 | CP45.2 CS45.2
  Top 0.406: CS45.2 446.95,201.47 441.71,196.23 SENS45.3 441.55,196.23 436.31,201.47 434.09,201.47 CS44.2 | CS46.2 460.28,201.47 460.28,203.69 CP46.2 | CS46.2 460.12,201.47 454.88,196.23 SENS46.3 454.73,196.23 449.65,201.31 447.26,201.31 CS45.2 | CS47.2 473.62,201.47 473.62,203.69 CP47.2 | CS47.2 473.46,201.31 468.38,196.23 SENS47.3 468.06,196.39 463.14,201.31 460.44,201.31 CS46.2 | CP48.2 486.79,203.69 486.79,201.47 CS48.2 486.63,201.31 481.55,196.23 SENS48.3 481.24,196.23 476,201.47 473.78,201.47 CS47.2 | CS17.2 288.67,184.96 288.67,187.18 CP17.2 | SENS17.3 283.43,179.72 288.51,184.8 CS17.2 | CS18.2 301.85,184.96 301.85,187.18 CP18.2 | CS18.2 301.69,184.8 296.61,179.72 SENS18.3 296.29,179.72 291.05,184.96 288.83,184.96 CS17.2 | CP19.2 CS19.2 | CS19.2 314.87,184.96 309.63,179.72 SENS19.3 309.47,179.72 304.23,184.96 302.01,184.96 CS18.2 | CS20.2 328.2,184.96 328.2,187.18 CP20.2 | CS20.2 328.04,184.96 322.8,179.72 SENS20.3 322.65,179.72 317.57,184.8 315.18,184.8 CS19.2 | CS21.2 341.54,184.96 341.54,187.18 CP21.2 | CS21.2 341.38,184.8 336.3,179.72 SENS21.3 335.98,179.88 331.06,184.8 328.36,184.8 CS20.2 | CS22.2 354.71,184.96 354.71,187.18 CP22.2 | CS22.2 354.55,184.8 349.47,179.72 SENS22.3 349.16,179.72 343.92,184.96 341.7,184.96 CS21.2 | CS23.2 367.89,184.96 367.89,187.18 CP23.2 367.73,187.18 363.92,190.99 363.92,193.85 362.65,195.12 362.65,196.07 SENS39.3 | CS23.2 367.73,184.8 362.65,179.72 SENS23.3 | CP24.2 CS24.2 | CS24.2 380.91,184.96 375.67,179.72 SENS24.3 375.51,179.72 370.27,184.96 368.05,184.96 CS23.2 | CS22.2 354.87,184.96 357.09,184.96 362.33,179.72 SENS23.3
  Top 0.406: CS25.2 394.24,184.96 394.24,187.18 CP25.2 | CS25.2 394.08,184.96 388.84,179.72 SENS25.3 388.69,179.72 383.61,184.8 381.22,184.8 CS24.2 | CS26.2 407.58,184.96 407.58,187.18 CP26.2 | CS26.2 407.42,184.8 402.34,179.72 SENS26.3 402.02,179.88 397.1,184.8 394.4,184.8 CS25.2 | CS27.2 420.75,184.96 420.75,187.18 CP27.2 | CS27.2 420.59,184.8 415.51,179.72 SENS27.3 415.2,179.72 409.96,184.96 407.74,184.96 CS26.2 | CS28.2 433.93,184.96 433.93,187.18 CP28.2 | CS28.2 433.77,184.8 428.69,179.72 SENS28.3 428.37,179.72 423.13,184.96 420.91,184.96 CS27.2 | CP29.2 CS29.2 | CS29.2 446.95,184.96 441.71,179.72 SENS29.3 441.55,179.72 436.31,184.96 434.09,184.96 CS28.2 | CS30.2 460.28,184.96 460.28,187.18 CP30.2 | CS30.2 460.12,184.96 454.88,179.72 SENS30.3 454.73,179.72 449.65,184.8 447.26,184.8 CS29.2 | CS31.2 473.62,184.96 473.62,187.18 CP31.2 | CS31.2 473.46,184.8 468.38,179.72 SENS31.3 468.06,179.88 463.14,184.8 460.44,184.8 CS30.2 | CP32.2 486.79,187.18 486.79,184.96 CS32.2 486.63,184.8 481.55,179.72 SENS32.3 481.24,179.72 476,184.96 473.78,184.96 CS31.2 | 435.83,107.49 435.83,109.87 C14.2 | 435.83,107.49 435.83,107.33 | 435.83,107.33 435.83,104.79 C15.2 | A6.23 451.87,106.38 451.87,106.85 A6.24 451.87,107.17 451.87,107.33 | 451.87,107.33 451.87,107.65 A6.25 451.87,107.81 451.87,108.28 A6.26 | A6.10 442.5,106.38 442.5,106.85 A6.9 442.5,107.17 442.5,107.33 | 442.5,107.33 442.5,107.65 A6.8 442.5,107.81 442.5,108.28 A6.7 | A6.33 442.5,107.33 | A6.33 451.87,107.33 | 442.5,107.33 435.83,107.33 | C12.2 373.6,112.41 373.6,107.33 C13.2 373.76,108.12 380.11,108.12 A5.7 380.27,108.28 380.27,107.81 A5.8 380.27,107.65 380.27,107.33
  Top 0.406: A5.23 389.64,106.38 389.64,106.85 A5.24 389.64,107.17 389.64,107.33 | 389.64,107.33 389.64,107.65 A5.25 | A5.26 389.64,108.28 389.64,107.81 A5.25 | A5.10 380.27,106.38 380.27,106.85 A5.9 380.27,107.17 380.27,107.33 | 380.27,107.33 A5.33 389.64,107.33 | 435.83,107.49 389.8,107.49 A5.25 | CP13.2 CS13.2 | CS13.2 446.95,168.45 441.71,163.21 SENS13.3 440.76,163.21 439.64,162.1 438.69,162.1 437.9,162.89 437.9,164 433.77,168.13 CS12.2 | CS14.2 460.28,168.45 460.28,170.67 CP14.2 | CS14.2 460.12,168.45 454.88,163.21 SENS14.3 454.73,163.21 449.65,168.29 447.26,168.29 CS13.2 | CS15.2 473.62,168.45 473.62,170.67 CP15.2 | CS15.2 473.46,168.29 468.38,163.21 SENS15.3 468.06,163.37 463.14,168.29 460.44,168.29 CS14.2 | CP16.2 486.79,170.67 486.79,168.45 CS16.2 486.63,168.29 481.55,163.21 SENS16.3 | CS15.2 473.78,168.45 476,168.45 481.24,163.21 SENS16.3 | CS1.2 288.67,168.45 288.67,170.67 CP1.2 | SENS1.3 283.43,163.21 288.51,168.29 CS1.2 | CS2.2 301.85,168.45 301.85,170.67 CP2.2 | CS2.2 301.69,168.29 296.61,163.21 SENS2.3 296.29,163.21 291.05,168.45 288.83,168.45 CS1.2 | CP3.2 CS3.2 | CS3.2 314.87,168.45 309.63,163.21 SENS3.3 309.47,163.21 304.23,168.45 302.01,168.45 CS2.2 | CS4.2 328.2,168.45 328.2,170.67 CP4.2 | CS4.2 328.04,168.45 322.8,163.21 SENS4.3 322.65,163.21 317.57,168.29 315.18,168.29 CS3.2 | 362.65,164.64 366.3,168.29 367.73,168.29 CS7.2 367.89,168.45 367.89,170.67 CP7.2 367.73,170.67 363.92,174.48 363.92,177.34 362.65,178.61 362.65,179.56 SENS23.3 | 362.65,164.64 362.65,163.21 SENS7.3 | CS5.2 341.54,168.45 341.54,170.67 CP5.2 | CS5.2 341.38,168.29 336.3,163.21 SENS5.3 335.98,163.37 331.06,168.29 328.36,168.29 CS4.2
  Top 0.406: CS6.2 354.71,168.45 354.71,170.67 CP6.2 | CS6.2 354.55,168.29 349.47,163.21 SENS6.3 349.16,163.21 343.92,168.45 341.7,168.45 CS5.2 | 362.65,164.64 358.68,164.64 354.87,168.45 CS6.2 | CP8.2 CS8.2 | U1.23 377.41,154.8 377.1,154.8 U1.24 377.1,154.96 377.1,161.94 375.83,163.21 SENS8.3 375.83,163.37 380.91,168.45 CS8.2 | v372.18,160.99 372.18,149.88 369.79,147.49 R2.1 | CS9.2 394.24,168.45 394.24,170.67 CP9.2 | C1.2 392.5,159.72 389,163.21 SENS9.3 | CS9.2 394.24,168.29 389.16,163.21 SENS9.3 | CS12.2 433.93,168.45 433.93,170.67 CP12.2 | CS12.2 433.77,168.29 428.69,163.21 SENS12.3 428.37,163.21 420.91,170.67 CP11.2 420.75,170.67 420.75,168.45 CS11.2 420.59,168.29 415.51,163.21 SENS11.3 415.2,163.21 409.96,168.45 407.74,168.45 CS10.2 | CS10.2 407.58,168.45 407.58,170.67 CP10.2 | CS10.2 407.42,168.29 402.34,163.21 SENS10.3 402.02,163.37 397.1,168.29 394.4,168.29 CS9.2 | CS8.2 381.22,168.29 383.92,168.29 388.84,163.37 SENS9.3 | SENS16.3 449.33,131.14 449.33,107.49 A6.33 | CS81.2 21.97,201.47 21.97,203.69 CP81.2 | SENS81.3 16.73,196.23 21.81,201.31 CS81.2 | CS82.2 35.15,201.47 35.15,203.69 CP82.2 | CS82.2 34.99,201.31 29.91,196.23 SENS82.3 29.59,196.23 24.35,201.47 22.13,201.47 CS81.2 | CP83.2 CS83.2 | CS83.2 48.17,201.47 42.93,196.23 SENS83.3 42.77,196.23 37.53,201.47 35.31,201.47 CS82.2 | CS84.2 61.5,201.47 61.5,203.69 CP84.2 | CS84.2 61.34,201.47 56.1,196.23 SENS84.3 55.95,196.23 50.87,201.31 48.48,201.31 CS83.2 | CS85.2 74.84,201.47 74.84,203.69 CP85.2 | CS85.2 74.68,201.31 69.6,196.23 SENS85.3 69.28,196.39 64.36,201.31 61.66,201.31 CS84.2 | CS86.2 88.01,201.47 88.01,203.69 CP86.2
  Top 0.406: CS86.2 87.85,201.31 82.77,196.23 SENS86.3 82.46,196.23 77.22,201.47 75,201.47 CS85.2 | CS87.2 101.19,201.47 101.19,203.69 CP87.2 | CS87.2 101.03,201.31 95.95,196.23 SENS87.3 | CP88.2 CS88.2 | CS88.2 114.21,201.47 108.97,196.23 SENS88.3 108.81,196.23 103.57,201.47 101.35,201.47 CS87.2 | CS86.2 88.17,201.47 90.39,201.47 95.63,196.23 SENS87.3 | CS89.2 127.54,201.47 127.54,203.69 CP89.2 | CS89.2 127.38,201.47 122.14,196.23 SENS89.3 121.99,196.23 116.91,201.31 114.52,201.31 CS88.2 | CS90.2 140.88,201.47 140.88,203.69 CP90.2 | 135.48,197.5 139.29,201.31 140.72,201.31 CS90.2 | 135.48,197.5 135.48,196.23 SENS90.3 | CS89.2 127.7,201.31 131.51,201.31 135.32,197.5 135.48,197.5 | CS91.2 154.05,201.47 154.05,203.69 CP91.2 | CS91.2 153.89,201.31 148.81,196.23 SENS91.3 148.5,196.23 143.26,201.47 141.04,201.47 CS90.2 | CS92.2 167.23,201.47 167.23,203.69 CP92.2 | CS92.2 167.07,201.31 161.99,196.23 SENS92.3 161.67,196.23 156.43,201.47 154.21,201.47 CS91.2 | CP93.2 CS93.2 | CS93.2 180.25,201.47 175.01,196.23 SENS93.3 174.85,196.23 169.61,201.47 167.39,201.47 CS92.2 | CS94.2 193.58,201.47 193.58,203.69 CP94.2 | CS94.2 193.42,201.47 188.18,196.23 SENS94.3 188.03,196.23 182.95,201.31 180.56,201.31 CS93.2 | CS95.2 206.92,201.47 206.92,203.69 CP95.2 | CS95.2 206.76,201.31 201.68,196.23 SENS95.3 201.36,196.39 196.44,201.31 193.74,201.31 CS94.2 | CP96.2 220.09,203.69 220.09,201.47 CS96.2 219.93,201.31 214.85,196.23 SENS96.3 214.54,196.23 209.3,201.47 207.08,201.47 CS95.2 | CS65.2 21.97,184.96 21.97,187.18 CP65.2 | SENS65.3 16.73,179.72 21.81,184.8 CS65.2 | CS66.2 35.15,184.96 35.15,187.18 CP66.2
  Top 0.406: CS66.2 34.99,184.8 29.91,179.72 SENS66.3 29.59,179.72 24.35,184.96 22.13,184.96 CS65.2 | CP67.2 CS67.2 | CS67.2 48.17,184.96 42.93,179.72 SENS67.3 42.77,179.72 37.53,184.96 35.31,184.96 CS66.2 | CS68.2 61.5,184.96 61.5,187.18 CP68.2 | CS68.2 61.34,184.96 56.1,179.72 SENS68.3 55.95,179.72 50.87,184.8 48.48,184.8 CS67.2 | CS69.2 74.84,184.96 74.84,187.18 CP69.2 | CS69.2 74.68,184.8 69.6,179.72 SENS69.3 69.28,179.88 64.36,184.8 61.66,184.8 CS68.2 | CS70.2 88.01,184.96 88.01,187.18 CP70.2 | CS70.2 87.85,184.8 82.77,179.72 SENS70.3 82.46,179.72 77.22,184.96 75,184.96 CS69.2 | CS73.2 127.54,184.96 127.54,187.18 CP73.2 | CS73.2 127.38,184.96 122.14,179.72 SENS73.3 121.99,179.72 116.91,184.8 114.52,184.8 CS72.2 | CS71.2 101.19,184.96 101.19,187.18 CP71.2 101.03,187.34 97.22,191.15 97.22,193.85 95.95,195.12 95.95,196.07 SENS87.3 | CS71.2 101.03,184.8 95.95,179.72 SENS71.3 | CP72.2 CS72.2 | CS72.2 114.21,184.96 108.97,179.72 SENS72.3 108.81,179.72 103.57,184.96 101.35,184.96 CS71.2 | CS70.2 88.17,184.96 90.71,184.96 95.79,179.88 SENS71.3 | CS74.2 140.88,184.96 140.88,187.18 CP74.2 | CS74.2 140.72,184.8 135.64,179.72 SENS74.3 135.32,179.88 130.4,184.8 127.7,184.8 CS73.2 | CS75.2 154.05,184.96 154.05,187.18 CP75.2 | CS75.2 153.89,184.8 148.81,179.72 SENS75.3 148.5,179.72 143.26,184.96 141.04,184.96 CS74.2 | CS78.2 193.58,184.96 193.58,187.18 CP78.2 | CS78.2 193.42,184.96 188.18,179.72 SENS78.3 188.03,179.72 182.95,184.8 180.56,184.8 CS77.2 | CS76.2 167.23,184.96 167.23,187.18 CP76.2 | CS76.2 167.07,184.8 161.99,179.72 SENS76.3 161.67,179.72 156.43,184.96 154.21,184.96 CS75.2
  Top 0.406: CP77.2 CS77.2 | CS77.2 180.25,184.96 175.01,179.72 SENS77.3 174.85,179.72 169.61,184.96 167.39,184.96 CS76.2 | C2.2 252.8,204.96 254.22,206.39 R11.1 | R11.1 254.38,206.55 258.03,210.2 R12.1 257.56,209.88 256.13,211.31 254.86,211.31 252.16,214.01 R13.1 | CS79.2 206.92,184.96 206.92,187.18 CP79.2 | CS79.2 206.76,184.8 201.68,179.72 SENS79.3 201.36,179.88 196.44,184.8 193.74,184.8 CS78.2 | U2.23 246.6,189.09 246.29,189.09 U2.24 246.13,188.93 243.91,188.93 | 243.91,188.93 221.68,188.93 220.09,187.34 CP80.2 220.09,187.02 220.09,184.96 CS80.2 219.93,184.96 SENS80.3 214.54,179.72 209.3,184.96 207.08,184.96 CS79.2 | 243.91,188.93 243.91,207.18 244.22,207.5 252.32,207.5 253.75,206.07 R11.1 | v308.83,10.81 307.41,12.24 TP4.P$1 307.41,31.13 293.28,45.26 A0.25 | 308.83,109.08 308.83,111.14 C10.2 | 308.83,109.08 308.83,108.12 | 308.83,108.12 308.83,106.06 C11.2 | A4.23 323.6,106.38 323.6,106.85 A4.24 323.6,107.17 323.6,107.33 | 323.6,107.33 323.6,107.65 A4.25 323.6,107.81 323.6,108.28 A4.26 | A4.10 314.23,106.38 314.23,106.85 A4.9 314.23,107.17 314.23,107.33 | 314.23,107.33 314.23,107.65 A4.8 314.23,107.81 314.23,108.28 A4.7 314.07,108.12 308.83,108.12 | 314.23,107.33 A4.33 323.6,107.33 | C17.2 273.12,43.83 273.12,45.74 275.66,48.27 275.66,50.18 C16.2 277.88,50.18 279.62,48.43 279.62,47.32 280.89,46.05 283.59,46.05 A0.7 283.75,46.05 283.75,45.58 A0.8 283.75,45.42 283.75,45.1 | A0.23 293.12,44.15 293.12,44.62 A0.24 293.12,44.94 293.12,45.1 | 293.12,45.1 293.12,45.42 A0.25 | A0.26 293.12,46.05 293.12,45.58 A0.25 | A0.10 283.75,44.15 283.75,44.62 A0.9 283.75,44.94 283.75,45.1
  Top 0.406: 283.75,45.1 A0.33 291.37,45.1 | 291.37,45.1 293.12,45.1 | 308.83,109.08 306.77,109.08 304.15,106.46 | 304.15,106.46 301.85,104.16 301.85,62.4 291.37,51.93 291.37,45.1 | 38.17,110.5 38.17,113.68 C4.2 | 38.17,110.5 38.17,108.6 C5.2 | A1.23 56.9,108.92 56.9,109.39 A1.24 56.9,109.71 56.9,109.87 | 56.9,109.87 56.9,110.19 A1.25 56.9,110.35 56.9,110.82 A1.26 57.06,110.66 101.19,110.66 102.78,112.25 102.94,112.25 | A1.10 47.53,108.92 47.53,109.39 A1.9 47.53,109.71 47.53,109.87 | 47.53,109.87 47.53,110.19 A1.8 47.53,110.35 47.53,110.5 | 47.53,110.5 47.53,110.82 A1.7 | 47.53,109.87 A1.33 56.9,109.87 | 47.53,110.5 38.17,110.5 | A3.10 179.61,107.65 179.61,108.12 A3.9 179.61,108.44 179.61,108.6 | 179.61,108.6 179.61,108.92 A3.8 | A3.7 179.61,109.55 179.61,109.08 A3.8 | 175.48,110.03 175.48,112.41 C8.2 | 175.48,110.03 175.48,108.92 | 175.48,108.92 175.48,107.33 C9.2 | 175.48,108.92 179.45,108.92 A3.8 | A3.23 188.98,107.65 188.98,108.12 A3.24 188.98,108.44 188.98,108.6 | 188.98,108.6 188.98,108.92 A3.25 188.98,109.08 188.98,109.55 A3.26 | 188.98,108.6 A3.33 179.61,108.6 | 102.94,112.25 102.94,113.68 C6.2 | 105.48,109.71 102.94,112.25 | 105.48,109.71 105.48,108.6 C7.2 | A2.23 121.67,108.92 121.67,109.39 A2.24 121.67,109.71 121.67,109.87 | 121.67,109.87 121.67,110.19 A2.25 | A2.26 121.67,110.82 121.67,110.35 A2.25 | A2.10 112.3,108.92 112.3,109.39 A2.9 | A2.9 112.3,109.71 112.3,110.19 A2.8 112.3,110.35 112.3,110.82 A2.7 | 114.37,109.39 116.43,109.39 A2.33 121.67,109.87 | 114.37,109.39 112.46,109.39 A2.9 | 105.48,109.71 112.14,109.71 A2.9 | 175.48,110.03 121.83,110.03 A2.25 | CS49.2 21.97,168.45 21.97,170.67 CP49.2
  Top 0.406: SENS49.3 16.73,163.21 21.81,168.29 CS49.2 | CS50.2 35.15,168.45 35.15,170.67 CP50.2 | CS50.2 34.99,168.29 29.91,163.21 SENS50.3 29.59,163.21 24.35,168.45 22.13,168.45 CS49.2 | CP51.2 CS51.2 | CS51.2 48.17,168.45 42.93,163.21 SENS51.3 42.77,163.21 37.53,168.45 35.31,168.45 CS50.2 | CS52.2 61.5,168.45 61.5,170.67 CP52.2 | CS52.2 61.34,168.45 56.1,163.21 SENS52.3 55.95,163.21 50.71,168.45 48.48,168.45 CS51.2 | U3.24 107.7,146.54 107.7,146.86 U3.23 107.54,146.86 107.22,146.86 | 107.22,146.86 105.95,146.86 100.4,152.42 100.4,154.32 C3.2 100.24,154.48 100.24,158.76 95.95,163.05 SENS55.3 | SENS55.3 95.95,163.21 101.03,168.29 CS55.2 101.19,168.45 101.19,170.67 CP55.2 101.03,170.67 99.44,172.26 99.44,173.37 97.22,175.59 97.22,177.34 95.95,178.61 95.95,179.56 SENS71.3 | CS53.2 74.84,168.45 74.84,170.67 CP53.2 | CS53.2 74.68,168.29 69.6,163.21 SENS53.3 69.28,163.37 64.36,168.29 61.66,168.29 CS52.2 | CS54.2 88.01,168.45 88.01,170.67 CP54.2 | CS54.2 87.85,168.29 82.77,163.21 SENS54.3 82.46,163.21 77.22,168.45 75,168.45 CS53.2 | SENS55.3 95.79,163.37 91.19,167.97 87.7,167.97 CS54.2 | C19.- C18.- | C18.- 261.53,155.59 U4.3 U4.6 242.64,155.59 243.75,156.7 243.75,167.81 | 243.75,167.81 R4.1 | MS1.4 262.96,119.39 266.61,123.05 266.61,127.65 | 266.61,127.65 266.61,132.57 RGB_SW.P$6 266.61,144 D2.A 266.77,147.97 261.69,153.05 C18.- | 266.61,127.65 PWR_SWITCH.P$1 | CP61.2 CS61.2 | CS61.2 180.25,168.45 175.01,163.21 SENS61.3 | CS62.2 193.58,168.45 193.58,170.67 CP62.2 | CS62.2 193.42,168.45 188.18,163.21 SENS62.3 188.03,163.21 182.95,168.29 180.56,168.29 CS61.2 | CS63.2 206.92,168.45 206.92,170.67 CP63.2
  Top 0.406: CS63.2 206.76,168.29 201.68,163.21 SENS63.3 201.36,163.37 196.44,168.29 193.74,168.29 CS62.2 | 221.2,169.56 TP8.P$1 228.82,169.56 230.57,167.81 243.75,167.81 | 221.2,169.56 220.09,170.67 CP64.2 | 221.2,169.56 220.09,168.45 CS64.2 219.93,168.45 SENS64.3 214.54,163.21 209.3,168.45 207.08,168.45 CS63.2 | CP56.2 CS56.2 | CS56.2 114.21,168.45 108.97,163.21 SENS56.3 | CS57.2 127.54,168.45 127.54,170.67 CP57.2 | R6.1 124.53,160.99 122.3,163.21 SENS57.3 | CS57.2 127.54,168.29 122.46,163.21 SENS57.3 | CS56.2 114.52,168.45 117.06,168.45 122.14,163.37 SENS57.3 | CP60.2 167.23,170.67 167.23,168.45 CS60.2 167.07,168.29 161.99,163.21 SENS60.3 161.67,163.21 154.21,170.67 CP59.2 154.05,170.67 154.05,168.45 CS59.2 153.89,168.29 148.81,163.21 SENS59.3 148.5,163.21 143.26,168.45 141.04,168.45 CS58.2 | CS58.2 140.88,168.45 140.88,170.67 CP58.2 | CS58.2 140.72,168.29 135.64,163.21 SENS58.3 135.32,163.37 130.4,168.29 127.7,168.29 CS57.2 | 114.37,109.39 114.37,136.86 107.22,144 107.22,146.86 | v303.75,106.85 304.15,106.46
  Bottom 0.406: SENS8.3 375.67,163.21 374.56,162.1 373.29,162.1 v372.18,160.99 364.87,160.99 362.65,163.21 SENS7.3 | v308.83,10.81 308.83,10.08 | 342.97,4.3 342.49,4.3 J1.GND | PWR_SWITCH.P$1 242.79,126.54 241.05,126.54 239.94,127.65 PWR_SWITCH.P$3 | SENS61.3 175.01,163.21 173.9,162.1 163.1,162.1 161.99,163.21 SENS60.3 | SENS55.3 95.95,163.21 97.06,162.1 107.86,162.1 108.97,163.21 SENS56.3 | v303.75,106.85 277.88,132.73 RGB_SW.P$6 | SENS1.3 281.53,161.46 261.69,161.46 C19.-
  Bottom 1.27: J1.GND__ J1.GND_ | J1.GND_ 339.92,9.37 340.83,9.37 342.5,7.7 342.5,5.84 342.97,5.37 342.97,4.3 342.97,3.19 | J1.GND_ 311.46,9.83 24V.P$2 308.83,10.08 5V.P$2 3.3V.P$2
  pour Top (hatched): 5.15,212.74 489.02,212.74 490.29,211.47 490.29,2.43 18.61,2.43 3.88,17.16 3.88,211.47
  pour Bottom (hatched): 14.04,221.63 487.75,221.63 489.02,220.36 489.02,34.94 489.02,3.19 487.75,1.92 7.69,1.92 2.61,1.92 1.34,3.19 1.34,208.93 1.34,220.36 2.61,221.63
MISO  (via drill 0.35)
  Top 0.203: v326.77,105.58 323.6,105.58 A4.22 | 388.05,104.79 388.37,105.11 388.37,105.27 388.69,105.58 389.48,105.58 A5.22 | 388.05,104.79 v386.94,103.68 | v450.12,105.58 451.71,105.58 A6.22 | 388.05,104.79 v388.21,104.79 | v55.47,106.7 55.47,107.65 55.95,108.12 56.74,108.12 A1.22 | v123.41,107.49 123.1,107.49 122.46,108.12 121.67,108.12 A2.22 | v291.37,43.51 292.96,43.51 A0.22 | v269.78,43.99 269.78,56.21 248.99,77.01 248.99,92.09 243.91,97.17 | MS1.13 243.91,97.17 | v194.06,105.58 192.79,106.85 188.98,106.85 A3.22 | v245.18,105.58 243.91,104.31 243.91,97.17
  Bottom 0.203: v386.94,103.68 328.68,103.68 v326.77,105.58 v245.18,105.58 | v450.12,105.58 449.33,104.79 v388.21,104.79 | v55.47,106.7 55.63,106.85 122.78,106.85 v123.41,107.49 125.95,104.95 194.69,104.95 | v291.37,43.51 270.26,43.51 v269.78,43.99 | 194.69,104.95 197.39,102.25 238.83,102.25 MS1.13 | 194.69,104.95 v194.06,105.58
MOSI  (via drill 0.35)
  Top 0.203: v106.11,150.19 106.75,149.56 107.54,149.56 U3.18 | v125.64,113.68 v124.68,114.63 | 119.92,107.17 v119.92,107.97 | 119.92,107.17 120.72,106.38 121.51,106.38 A2.19 | v58.64,105.11 58.64,105.27 57.69,106.22 56.9,106.22 A1.19 | 119.92,107.17 v118.97,106.22 | v388.21,103.84 389.48,103.84 A5.19 | v450.12,103.84 451.71,103.84 A6.19 | v248.83,186.71 249.3,187.18 249.3,188.93 U2.18 | v254.22,174.48 v250.57,178.13 | v244.7,122.25 244.7,106.06 242.64,104 242.64,102.25 | MS1.12 242.64,102.25 | v379.95,156.86 379.95,154.8 U1.18 | v285.97,41.61 292.96,41.61 A0.19 | v269.78,43.04 268.99,43.83 268.99,56.37 246.45,78.91 246.45,92.88 238.83,100.5 238.83,101.46 239.62,102.25 242.64,102.25 | v187.55,105.58 187.87,105.27 | 187.87,105.27 188.03,105.11 188.82,105.11 A3.19 | v315.98,103.84 322.17,103.84 | 322.17,103.84 323.44,103.84 A4.19 | 322.17,103.84 v322.17,106.22 | 187.87,105.27 v186.91,104.31
  Bottom 0.203: v106.11,150.19 106.27,150.03 113.41,150.03 124.68,138.76 v124.68,114.63 | v125.64,113.68 123.57,111.62 123.57,110.82 121.19,110.82 120.56,111.46 119.92,111.46 119.6,111.14 119.6,107.97 v119.92,107.97 | v58.64,105.11 59.76,106.22 v118.97,106.22 120.87,104.31 v186.91,104.31 | v450.12,103.84 v388.21,103.84 387.73,104.31 372.02,104.31 371.86,104.16 329.15,104.16 327.09,106.22 v322.17,106.22 | v248.83,186.71 249.46,187.34 250.1,187.34 250.57,186.86 v250.57,178.13 | v254.22,174.48 254.22,163.69 262,155.91 262.16,155.91 262.8,155.27 262.8,155.11 | 262.8,155.11 262.8,134.16 256.61,134.16 v244.7,122.25 | v379.95,156.86 378.21,155.11 262.8,155.11 | v285.97,41.61 284.55,43.04 v269.78,43.04 | v187.55,105.58 188.18,106.22 237.4,106.22 MS1.12 246.76,105.11 314.71,105.11 v315.98,103.84
MUX1  (via drill 0.35)
  Top 0.203: v380.59,156.07 380.59,154.8 U1.17 | v283.43,100.98 v336.93,154.48
  Bottom 0.203: v380.59,156.07 379,154.48 v336.93,154.48 | v283.43,100.98 277.08,94.63 258.83,94.63 250.26,86.06 MS1.24
MUX2  (via drill 0.35)
  Top 0.203: v249.78,186.71 249.78,188.93 U2.17 | v241.21,172.89 v245.81,177.5 | v241.05,166.38 241.05,162.58 237.71,159.24 237.71,146.7 240.89,143.52 240.89,120.98 236.29,116.38 v236.29,90.03
  Bottom 0.203: v249.78,186.71 245.81,182.74 v245.81,177.5 | v241.21,172.89 241.21,168.61 240.89,168.61 239.62,167.34 239.62,166.38 v241.05,166.38 | v236.29,90.03 244.38,81.93 246.45,81.93 MS1.23
MUX3  (via drill 0.35)
  Top 0.203: v137.07,114.95 107.7,144.32 107.7,144.95 108.81,146.07 108.81,149.72 108.49,150.03 107.7,150.03 U3.17 | v210.09,114.79 240.73,84.15 244.06,84.15 245.18,83.04 MS1.22
  Bottom 0.203: v137.07,114.95 137.23,114.79 v210.09,114.79
N$1
  Top 0.203: 250.41,146.86 250.41,145.27 D2.C | 250.41,146.86 250.41,152.73 251.53,153.84 252.64,153.84 U4.2 | 250.41,146.86 246.45,142.89 L1.1
N$2  (via drill 0.35)
  Top 0.203: v381.54,108.28 381.54,111.62 381.07,112.09 380.27,112.09 A5.1 | v371.54,104.79 371.54,93.36 370.27,92.09 N5.P16
  Bottom 0.203: v381.54,108.28 378.05,104.79 v371.54,104.79
N$3  (via drill 0.35)
  Top 0.203: v378.21,111.62 380.11,111.62 A5.2 | v372.81,110.82 372.81,108.76 372.18,108.12 372.18,92.09 N5.P15
  Bottom 0.203: v378.21,111.62 377.41,110.82 v372.81,110.82
N$4  (via drill 0.35)
  Top 0.203: v377.89,109.55 378.53,110.19 380.11,110.19 A5.4 | v377.89,105.58 377.89,104.79 374.24,101.14 374.24,92.09 N5.P14
  Bottom 0.203: v377.89,105.58 v377.89,109.55
N$5  (via drill 0.35)
  Top 0.203: v378.84,109.55 380.11,109.55 A5.5 | v378.84,106.54 378.84,105.11 376.14,102.41 376.14,92.09 N5.P13
  Bottom 0.203: v378.84,106.54 v378.84,109.55
N$6
  Top 0.203: A5.12 380.11,104.95 379.32,104.95 378.05,103.68 378.05,92.09 N5.P12
N$7
  Top 0.203: A5.13 380.11,104.31 379.32,104.31 378.53,103.52 378.53,93.68 N5.P11
N$8
  Top 0.203: A5.15 380.11,103.04 379.32,103.04 379,102.73 379,95.11 382.02,92.09 N5.P10
N$9
  Top 0.203: A5.16 380.27,102.41 380.27,95.9 384.08,92.09 N5.P9
N$10
  Top 0.203: A5.17 389.48,102.41 389.48,95.42 386.15,92.09 N5.P8
N$11
  Top 0.203: A5.18 389.64,103.04 390.43,103.04 390.75,102.73 390.75,94.63 388.21,92.09 N5.P7
N$12
  Top 0.203: A5.20 389.64,104.31 390.43,104.31 391.23,103.52 391.23,93.04 390.27,92.09 N5.P6
N$13
  Top 0.203: A5.21 389.64,104.95 390.43,104.95 392.02,103.36 392.02,92.09 N5.P5
N$14  (via drill 0.35)
  Top 0.203: v391.7,108.28 390.43,109.55 389.64,109.55 A5.28 | v393.29,106.7 392.34,105.74 392.34,103.68 394.08,101.93 394.08,92.09 N5.P4
  Bottom 0.203: v393.29,106.7 v391.7,108.28
N$15  (via drill 0.35)
  Top 0.203: v388.21,109.71 388.69,110.19 389.48,110.19 A5.29 | v392.97,105.43 392.97,104.31 395.99,101.3 395.99,92.09 N5.P3
  Bottom 0.203: v388.21,109.71 392.5,105.43 v392.97,105.43
N$16  (via drill 0.35)
  Top 0.203: v388.21,111.46 389.48,111.46 A5.31 | v396.78,106.7 396.78,93.36 398.05,92.09 N5.P2
  Bottom 0.203: v388.21,111.46 388.84,110.82 392.65,110.82 v396.78,106.7
N$17  (via drill 0.35)
  Top 0.203: v394.24,108.28 390.43,112.09 389.64,112.09 A5.32 | v397.42,105.9 397.42,94.79 N5.P1
  Bottom 0.203: v394.24,108.28 396.62,105.9 v397.42,105.9
N$18  (via drill 0.35)
  Top 0.203: v448.06,112.09 442.5,112.09 A6.1
  Bottom 0.203: v448.06,112.09 452.66,107.49 452.66,91.14 434.72,91.14 433.77,92.09 N6.P16
N$19  (via drill 0.35)
  Top 0.203: v441.07,111.62 442.34,111.62 A6.2 | v439.8,105.9 439.8,104.47 435.68,100.35 435.68,92.09 N6.P15
  Bottom 0.203: v441.07,111.62 439.8,110.35 v439.8,105.9
N$20  (via drill 0.35)
  Top 0.203: v441.07,109.71 441.55,110.19 442.34,110.19 A6.4 | v441.07,105.9 441.07,105.11 437.74,101.77 437.74,92.09 N6.P14
  Bottom 0.203: v441.07,105.9 v441.07,109.71
N$21  (via drill 0.35)
  Top 0.203: v444.09,109.55 442.5,109.55 A6.5
  Bottom 0.203: v444.09,109.55 444.57,109.08 450.44,109.08 450.76,108.76 450.76,93.2 440.76,93.2 439.64,92.09 N6.P13
N$22
  Top 0.203: A6.12 442.34,104.95 441.55,104.95 440.76,104.16 440.76,92.88 441.55,92.09 N6.P12
N$23
  Top 0.203: A6.13 442.34,104.31 441.55,104.31 441.23,104 441.23,94.47 N6.P11
N$24